# Altium schematic sheet Sheet-circuit_de_puissance.SchDoc: Power Control Board
size A; CheckedBy: TunBra; DrawnBy: Iheb wesleti; SheetNumber: 1; SheetTotal: 3; Number: 3
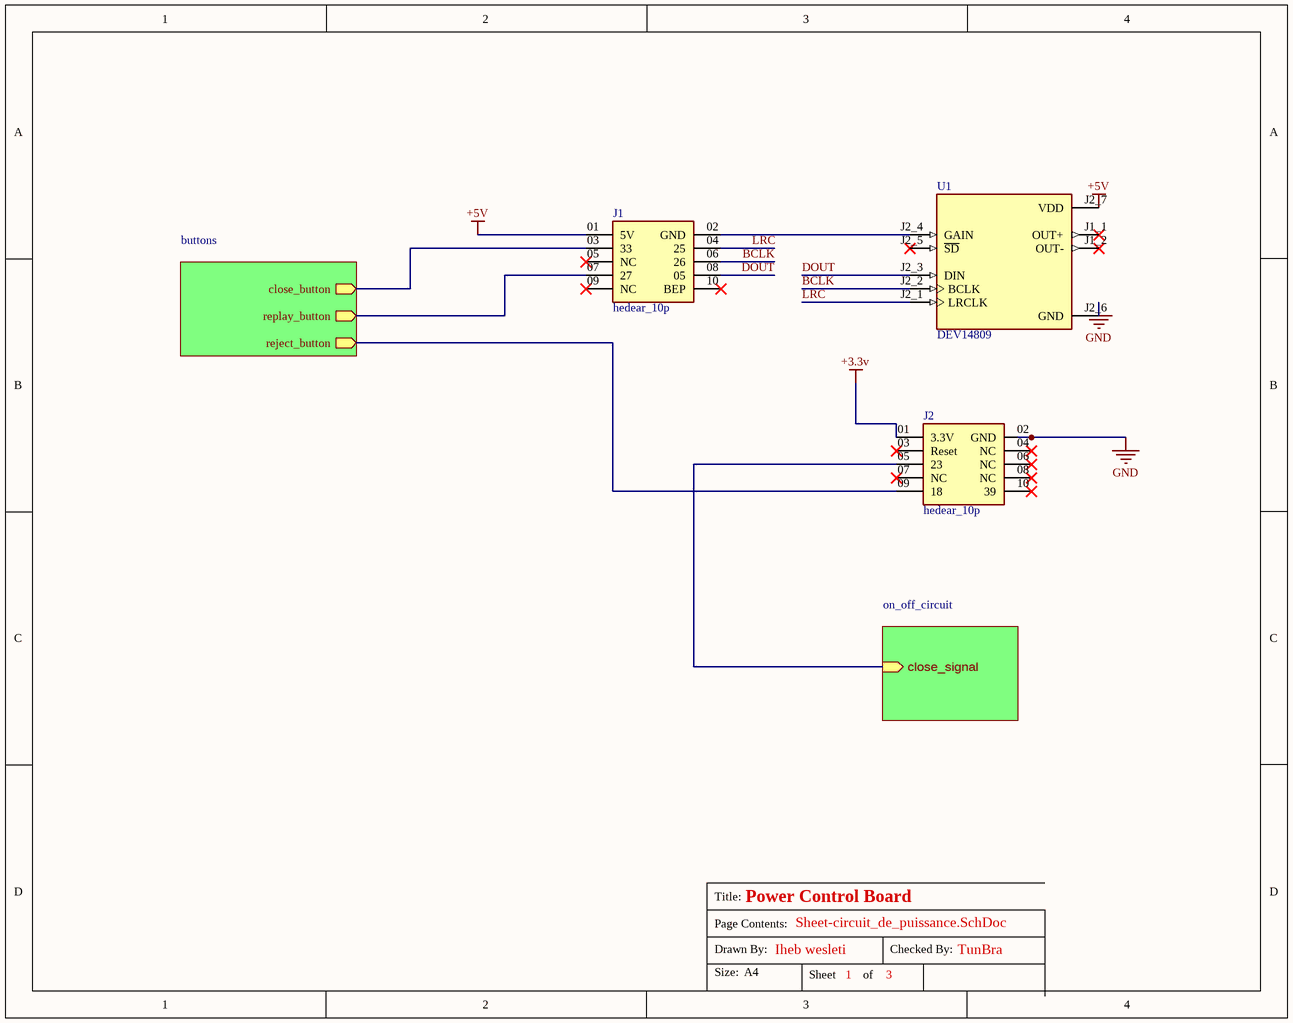
[diagram p0: Sheet-circuit_de_puissance.SchDoc]

## Parts
J1  hedear_10p  [hedear10p]
J2  hedear_10p  [hedear10p]
U1  DEV14809  [MODULEson_DEV14809]

## Sub-sheets
buttons = buttons: close_button (out), replay_button (out), reject_button (out)
on_off_circuit = circuit_on_off: close_signal (in)

## Nets
+3.3v: J2.01(3.3V)
+5V: J1.01(5V) U1.J2_7(VDD)
GND: J2.02(GND) U1.J2_6(GND)
BCLK: J1.06(26) U1.J2_2(BCLK)
DOUT: J1.08(05) U1.J2_3(DIN)
LRC: J1.04(25) U1.J2_1(LRCLK)
NetJ1_02: J1.02(GND) U1.J2_4(GAIN)
NetJ1_03: J1.03(33) ; sheet buttons/close_button
NetJ1_07: J1.07(27) ; sheet buttons/replay_button
NetJ2_05: J2.05(23) ; sheet on_off_circuit/close_signal
NetJ2_09: J2.09(18) ; sheet buttons/reject_button

Not connected (* = marked no-connect by the designer): J1 05(NC)* 09(NC)* 10(BEP)*; J2 03(Reset)* 04(NC)* 06(NC)* 07(NC)* 08(NC)* 10(39)*; U1 J1_1(OUT+)* J1_2(OUT-)* J2_5(~{SD})*

## Notes on the sheet
- Title:
- Size:
- Drawn By:
- Page Contents:
- A4
- Sheet
- of
- Checked By:
- 3

## Library data of the parts
J1 = hedear_10p: MP: TSS-105-02-L-D; Package: None; Price: None; Value: *; Availability: Unavailable
J2 = hedear_10p_1: MP: TSS-105-02-L-D; Package: None; Price: None; Value: *; Availability: Unavailable
U1 = DEV14809: MAX98357A Audio Interface Audio - Platform Evaluation Expansion Board; MF: Sparkfun Electronics; SnapEDA_Link: https://www.snapeda.com/parts/DEV14809/SparkFun+Electronics/view-part/?ref=snap; Package: None; Value: *; MP: DEV14809; Check_prices: https://www.snapeda.com/parts/DEV14809/SparkFun+Electronics/view-part/?ref=eda